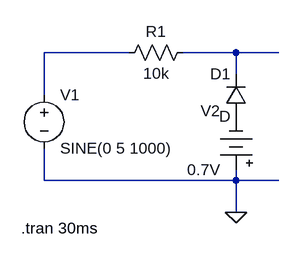
[diagram p0: schematic negative clipper.asc]
negative clipper.asc, the LTspice schematic file:
Version 4
SHEET 1 880 680
WIRE 160 48 32 48
WIRE 320 48 240 48
WIRE 384 48 320 48
WIRE 320 80 320 48
WIRE 32 112 32 48
WIRE 32 240 32 192
WIRE 320 240 320 224
WIRE 320 240 32 240
WIRE 384 240 320 240
WIRE 320 288 320 240
FLAG 320 288 0
SYMBOL res 256 32 R90
WINDOW 0 0 56 VBottom 2
WINDOW 3 32 56 VTop 2
SYMATTR InstName R1
SYMATTR Value 10k
SYMBOL voltage 32 96 R0
WINDOW 123 0 0 Left 0
WINDOW 39 0 0 Left 0
SYMATTR InstName V1
SYMATTR Value SINE(0 5 1000)
SYMBOL diode 336 144 R180
WINDOW 0 24 64 Left 2
WINDOW 3 24 0 Left 2
SYMATTR InstName D1
SYMBOL Misc\\battery 320 240 R180
WINDOW 0 24 104 Left 2
WINDOW 3 24 16 Left 2
WINDOW 123 0 0 Left 0
WINDOW 39 0 0 Left 0
SYMATTR InstName V2
SYMATTR Value 0.7V
TEXT -2 312 Left 2 !.tran 30ms

The netlist it stands for:
* negative clipper.asc
R1 N002 N001 10k
V1 N001 0 SINE(0 5 1000)
D1 P001 N002 D
V2 0 P001 0.7V
.model D D
.lib standard.dio
.tran 30ms
.backanno
.end